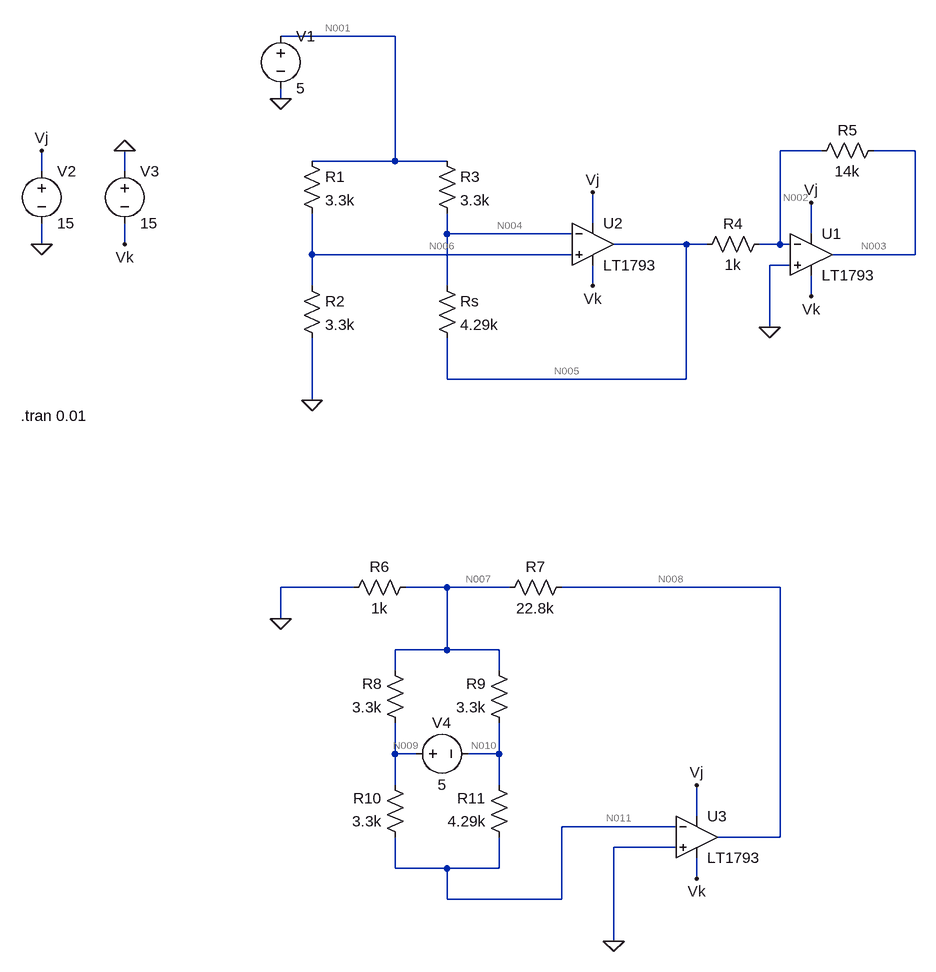
[diagram p0: schematic 6410_hw03.asc]
6410_hw03.asc, the LTspice schematic file:
Version 4.1
SHEET 1 1012 1316
WIRE 208 -96 32 -96
WIRE 32 0 32 -16
WIRE 864 80 800 80
WIRE 1008 80 944 80
WIRE 208 96 208 -96
WIRE 208 96 80 96
WIRE 288 96 208 96
WIRE -336 112 -336 80
WIRE -208 112 -208 80
WIRE 512 192 512 144
WIRE 288 208 288 176
WIRE 480 208 288 208
WIRE 848 208 848 160
WIRE -336 224 -336 192
WIRE -208 224 -208 192
WIRE 656 224 544 224
WIRE 688 224 656 224
WIRE 800 224 800 80
WIRE 800 224 768 224
WIRE 816 224 800 224
WIRE 80 240 80 176
WIRE 480 240 80 240
WIRE 1008 240 1008 80
WIRE 1008 240 880 240
WIRE 816 256 784 256
WIRE 80 288 80 240
WIRE 288 288 288 208
WIRE 512 288 512 256
WIRE 848 304 848 272
WIRE 784 352 784 256
WIRE 288 432 288 368
WIRE 656 432 656 224
WIRE 656 432 288 432
WIRE 80 464 80 368
WIRE 144 752 32 752
WIRE 288 752 224 752
WIRE 384 752 288 752
WIRE 800 752 464 752
WIRE 32 800 32 752
WIRE 288 848 288 752
WIRE 288 848 208 848
WIRE 368 848 288 848
WIRE 208 880 208 848
WIRE 368 880 368 848
WIRE 208 1008 208 960
WIRE 240 1008 208 1008
WIRE 368 1008 368 960
WIRE 368 1008 320 1008
WIRE 208 1056 208 1008
WIRE 368 1056 368 1008
WIRE 672 1104 672 1056
WIRE 640 1120 464 1120
WIRE 800 1136 800 752
WIRE 800 1136 704 1136
WIRE 640 1152 544 1152
WIRE 208 1184 208 1136
WIRE 288 1184 208 1184
WIRE 368 1184 368 1136
WIRE 368 1184 288 1184
WIRE 672 1200 672 1168
WIRE 288 1232 288 1184
WIRE 464 1232 464 1120
WIRE 464 1232 288 1232
WIRE 544 1296 544 1152
FLAG 32 0 0
FLAG 80 464 0
FLAG -336 224 0
FLAG -336 80 Vj
FLAG -208 80 0
FLAG -208 224 Vk
FLAG 512 288 Vk
FLAG 512 144 Vj
FLAG 848 304 Vk
FLAG 848 160 Vj
FLAG 784 352 0
FLAG 32 800 0
FLAG 672 1200 Vk
FLAG 672 1056 Vj
FLAG 544 1296 0
SYMBOL res 64 80 R0
SYMATTR InstName R1
SYMATTR Value 3.3k
SYMBOL res 64 272 R0
SYMATTR InstName R2
SYMATTR Value 3.3k
SYMBOL res 272 80 R0
SYMATTR InstName R3
SYMATTR Value 3.3k
SYMBOL res 272 272 R0
SYMATTR InstName Rs
SYMATTR Value 4.29k
SYMBOL voltage 32 -112 R0
SYMATTR InstName V1
SYMATTR Value 5
SYMBOL voltage -336 96 R0
SYMATTR InstName V2
SYMATTR Value 15
SYMBOL voltage -208 96 R0
SYMATTR InstName V3
SYMATTR Value 15
SYMBOL OpAmps\\LT1793 512 160 R0
SYMATTR InstName U2
SYMBOL OpAmps\\LT1793 848 176 R0
SYMATTR InstName U1
SYMBOL res 784 208 R90
WINDOW 0 0 56 VBottom 2
WINDOW 3 32 56 VTop 2
SYMATTR InstName R4
SYMATTR Value 1k
SYMBOL res 960 64 R90
WINDOW 0 0 56 VBottom 2
WINDOW 3 32 56 VTop 2
SYMATTR InstName R5
SYMATTR Value 14k
SYMBOL res 240 736 R90
WINDOW 0 0 56 VBottom 2
WINDOW 3 32 56 VTop 2
SYMATTR InstName R6
SYMATTR Value 1k
SYMBOL res 480 736 R90
WINDOW 0 0 56 VBottom 2
WINDOW 3 32 56 VTop 2
SYMATTR InstName R7
SYMATTR Value 22.8k
SYMBOL res 224 976 R180
WINDOW 0 36 76 Left 2
WINDOW 3 36 40 Left 2
SYMATTR InstName R8
SYMATTR Value 3.3k
SYMBOL res 384 976 R180
WINDOW 0 36 76 Left 2
WINDOW 3 36 40 Left 2
SYMATTR InstName R9
SYMATTR Value 3.3k
SYMBOL res 224 1152 R180
WINDOW 0 36 76 Left 2
WINDOW 3 36 40 Left 2
SYMATTR InstName R10
SYMATTR Value 3.3k
SYMBOL res 384 1152 R180
WINDOW 0 36 76 Left 2
WINDOW 3 36 40 Left 2
SYMATTR InstName R11
SYMATTR Value 4.29k
SYMBOL OpAmps\\LT1793 672 1072 R0
SYMATTR InstName U3
SYMBOL voltage 224 1008 R270
WINDOW 0 32 56 VTop 2
WINDOW 3 -32 56 VBottom 2
SYMATTR InstName V4
SYMATTR Value 5
TEXT -368 488 Left 2 !.tran 0.01

The netlist it stands for:
* 6410_hw03.asc
R1 N001 N006 3.3k
R2 N006 0 3.3k
R3 N001 N004 3.3k
Rs N004 N005 4.29k
V1 N001 0 5
V2 Vj 0 15
V3 0 Vk 15
X§U2 N006 N004 Vj Vk N005 LT1793  ; pins In+ In- V+ V- OUT
X§U1 0 N002 Vj Vk N003 LT1793  ; pins In+ In- V+ V- OUT
R4 N002 N005 1k
R5 N003 N002 14k
R6 N007 0 1k
R7 N008 N007 22.8k
R8 N009 N007 3.3k
R9 N010 N007 3.3k
R10 N011 N009 3.3k
R11 N011 N010 4.29k
X§U3 0 N011 Vj Vk N008 LT1793  ; pins In+ In- V+ V- OUT
V4 N009 N010 5
.tran 0.01
.lib LTC.lib
.backanno
.end

* Results of the author's LTspice run, read from the files saved beside the schematic
* Operating Point, zero values left out:
*   V(n001) = 5 V
*   V(n002) = -2.355 µV
*   V(n003) = 10.5 V
*   V(n004) = 2.5 V
*   V(n005) = -750 mV
*   V(n006) = 2.5 V
*   V(n007) = -326.1 mV
*   V(n008) = -7.761 V
*   V(n009) = 2.174 V
*   V(n010) = -2.826 V
*   V(n011) = 1.738 µV
*   V(vj) = 15 V
*   V(vk) = -15 V
*   I(R1) = 757.6 µA
*   I(R10) = -658.8 µA
*   I(R11) = 658.8 µA
*   I(R2) = 757.6 µA
*   I(R3) = 757.6 µA
*   I(R4) = 750 µA
*   I(R5) = 750 µA
*   I(R6) = -326.1 µA
*   I(R7) = -326.1 µA
*   I(R8) = 757.6 µA
*   I(R9) = -757.6 µA
*   I(Rs) = 757.6 µA
*   I(V1) = -1.515 mA
*   I(V2) = -12.27 mA
*   I(V3) = -13.35 mA
*   I(V4) = -1.416 mA
*   Ix(u1:3) = 4.615 mA
*   Ix(u1:4) = -3.865 mA
*   Ix(u1:5) = -750 µA
*   Ix(u2:3) = 3.61 mA
*   Ix(u2:4) = -5.118 mA
*   Ix(u2:5) = 1.508 mA
*   Ix(u3:3) = 4.044 mA
*   Ix(u3:4) = -4.37 mA
*   Ix(u3:5) = 326.1 µA